# Altium schematic sheet Sheet1.SchDoc
size A
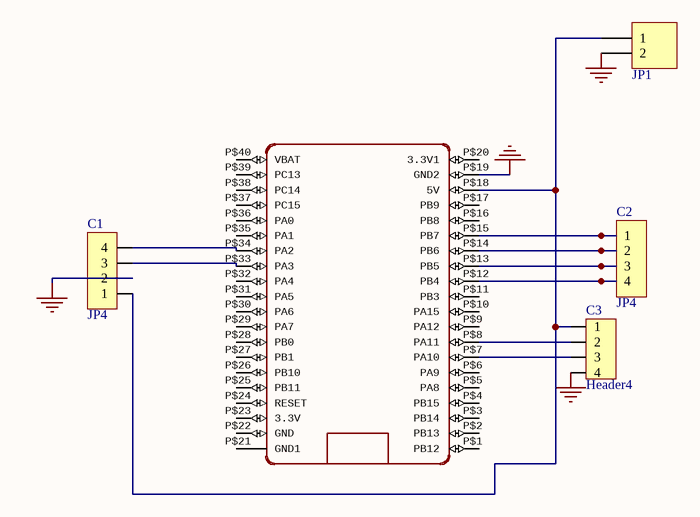
[diagram p0: Sheet1.SchDoc]

## Parts
C1  JP4  [JP4-C1T]
C2  JP4  [JP4-C1T]
C3  Header4  [Header4]
JP1  Header 2_1  [HED2]  (value not drawn)
U  BLUE_PILL  [BLUE_PILL]  (value not drawn)

## Nets
GND: C1.2 C3.4 JP1.2 U.P$19(GND2)
NetC1_1: C1.1 C3.1 JP1.1 U.P$18(5V)
NetC1_3: C1.3 U.P$33(PA3)
NetC1_4: C1.4 U.P$34(PA2)
NetC2_1: C2.1 U.P$15(PB7)
NetC2_2: C2.2 U.P$14(PB6)
NetC2_3: C2.3 U.P$13(PB5)
NetC2_4: C2.4 U.P$12(PB4)
NetC3_2: C3.2 U.P$8(PA11)
NetC3_3: C3.3 U.P$7(PA10)

Not connected (* = marked no-connect by the designer): U P$1(PB12) P$2(PB13) P$3(PB14) P$4(PB15) P$5(PA8) P$6(PA9) P$9(PA12) P$10(PA15) P$11(PB3) P$16(PB8) P$17(PB9) P$20(3.3V1) P$21(GND1) P$22(GND) P$23(3.3V) P$24(RESET) P$25(PB11) P$26(PB10) P$27(PB1) P$28(PB0) P$29(PA7) P$30(PA6) P$31(PA5) P$32(PA4) P$35(PA1) P$36(PA0) P$37(PC15) P$38(PC14) P$39(PC13) P$40(VBAT)

## Library data of the parts
C1 C2 = JP4: WR-PHD 2.54 mm Angled Socket Header; Manufacturer: W¨¹rth Elektronik eiSos GmbH; partNo: 613004143121; ComponentLink1 Description: Manufacturer; ComponentLink2 Description: Datasheet; NoPins: 04; Created Date: 29 March 2013; ComponentLink1URL: http://www.we-online.com; ComponentLink2URL: http://katalog.we-online.de/em/datasheet/6130xx143121.pdf; Created by: Karrer Zheng
C3 = Header4: Header IDC, 4 x 1 Pin Vertical 2.54mm Pitch (Non-Boxed, Male); Manufacturer: W¨¹rth Elektronik eiSos GmbH; partNo: 613002143121; ComponentLink1 Description: Manufacturer; ComponentLink2 Description: Datasheet; NoPins: 02; Created Date: 29 March 2013; ComponentLink1URL: http://www.we-online.com; ComponentLink2URL: http://katalog.we-online.de/em/datasheet/6130xx143121.pdf; Created by: Karrer Zheng
JP1 = Header 2_1: Header, 2-Pin; Manufacturer: Generic Components; Class: Connector; Value: Header 2
U = BLUE_PILL: GateName_1: G$1; SymbolName_1: BLUE_PILL; LibraryName: BluePill; DeviceSetName: BLUE_PILL; Package: BLUE_PILL